# EAGLE schematic gambar (EAGLE 9.6.2)
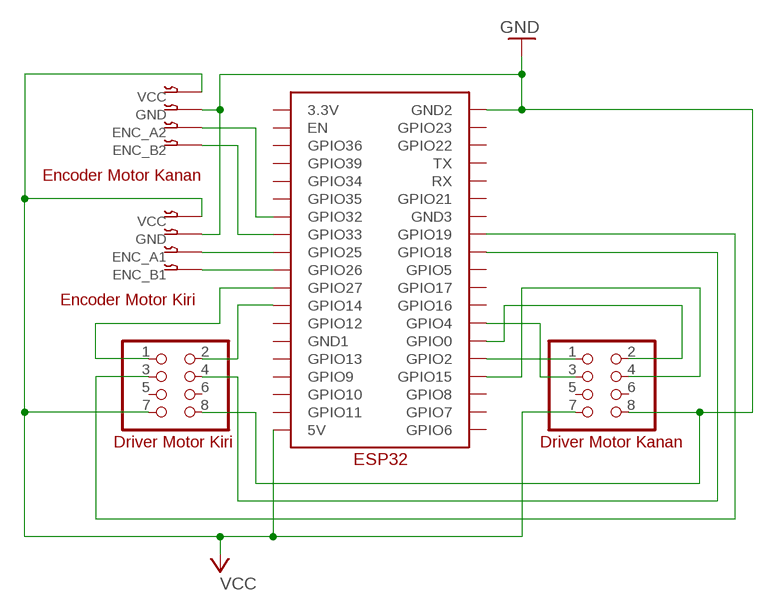
[diagram p0: schematic, sheet 1]

## Parts
DRIV1  PINHD-2X4  [2X04]
DRIV2  PINHD-2X4  [2X04]
U$1  ESP32_GRBL  [ESP32_GRBL]
X1  ENC1  04-JST-B4B-XH-A  [B4B-XH]
X2  ENC2  04-JST-B4B-XH-A  [B4B-XH]

## Nets
DRV1_LEN1: DRIV1.3 U$1.GPIO19
DRV1_LPWM1: DRIV1.2 U$1.GPIO14
DRV1_RPWM1: DRIV1.1 U$1.GPIO27
ENC_A1: U$1.GPIO25 X2.P$3
ENC_A2: U$1.GPIO32 X1.P$3
ENC_B1: U$1.GPIO26 X2.P$4
ENC_B2: U$1.GPIO33 X1.P$4
GND: DRIV1.8 DRIV2.8 U$1.GND2 X1.P$2 X2.P$2
N$1: DRIV2.1 U$1.GPIO2
N$2: DRIV2.2 U$1.GPIO0
N$3: DRIV2.3 U$1.GPIO4
N$4: DRIV2.4 U$1.GPIO15
N$5: DRIV1.4 U$1.GPIO18
VCC: DRIV1.7 DRIV2.7 U$1.5V X1.P$1 X2.P$1
Unconnected: DRIV1.5 DRIV1.6 DRIV2.5 DRIV2.6 U$1.3.3V U$1.EN U$1.GND1 U$1.GND3 U$1.GPIO5 U$1.GPIO6 U$1.GPIO7 U$1.GPIO8 U$1.GPIO9 U$1.GPIO10 U$1.GPIO11 U$1.GPIO12 U$1.GPIO13 U$1.GPIO16 U$1.GPIO17 U$1.GPIO21 U$1.GPIO22 U$1.GPIO23 U$1.GPIO34 U$1.GPIO35 U$1.GPIO36 U$1.GPIO39 U$1.RX U$1.TX

## Notes on the sheet
- Encoder Motor Kanan
- Encoder Motor Kiri
- Driver Motor Kiri | Driver Motor Kanan

## Library data of the parts
DRIV1 DRIV2 = pinhead:PINHD-2X4: PIN HEADER
U$1 = 00-ESP32:ESP32_GRBL
X1 X2 = 00-bt_con-jst-xh:04-JST: JST CONNECTOR